# Altium project ESP 32 S Project.PrjPcb
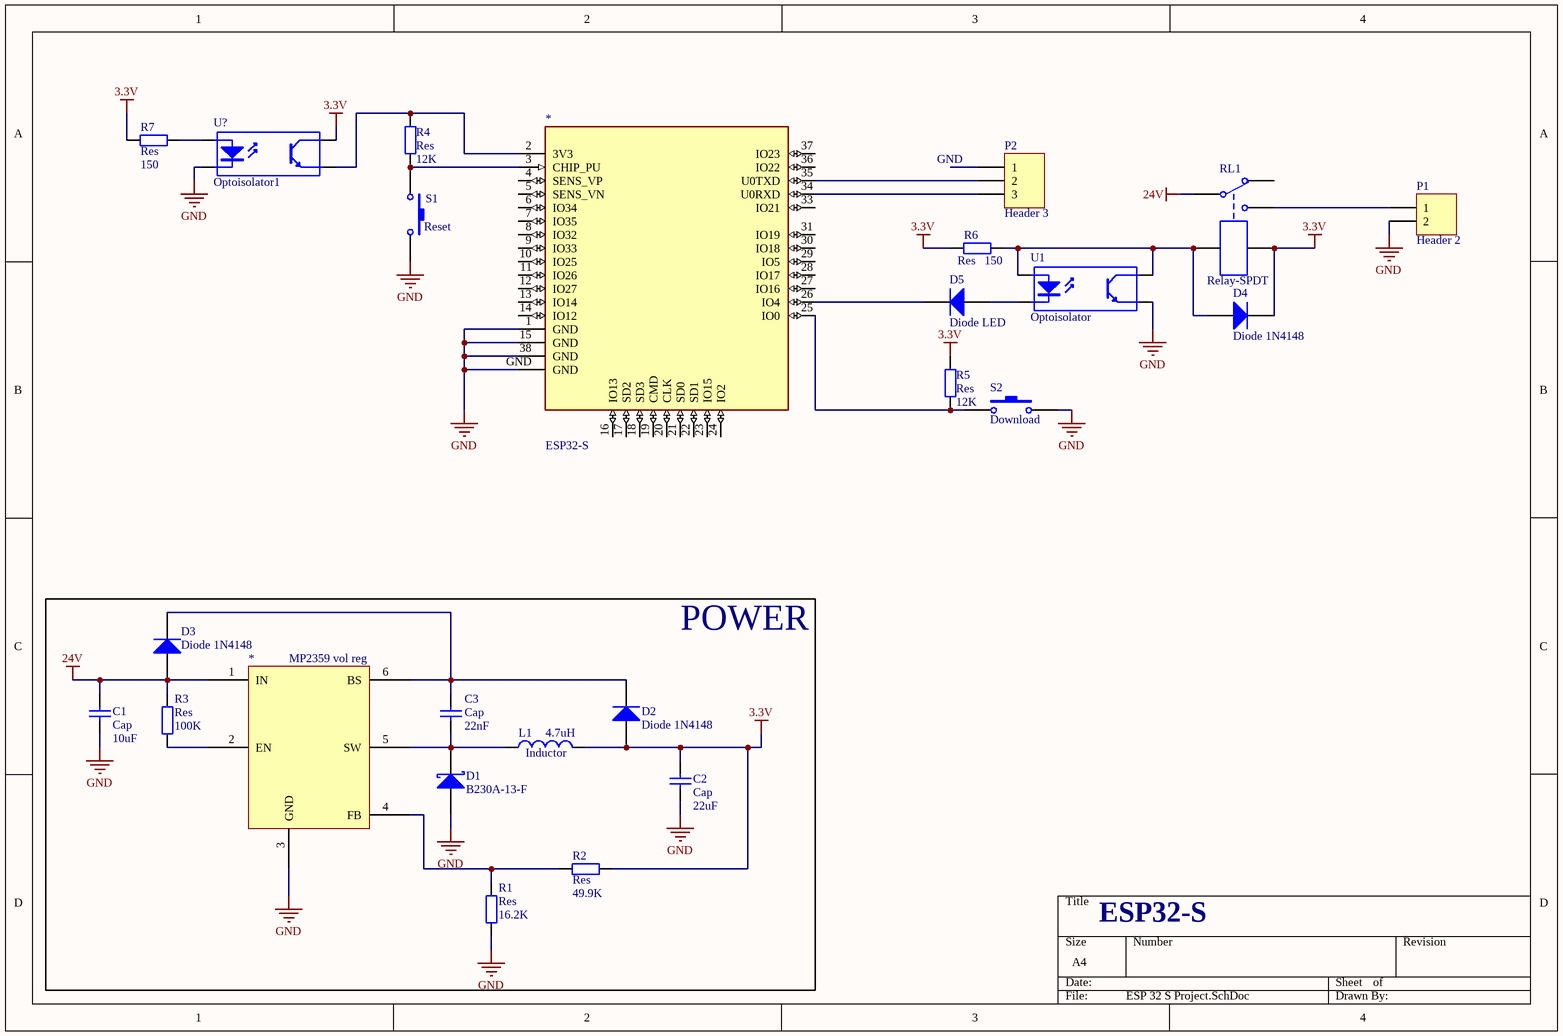
[diagram p0: ESP 32 S Project.SchDoc]
1 sheet, 25 parts. Net scope: global (net labels, ports and power ports of the same name join across sheets).
Board file: ESP 32 S Project PCB1.PcbDoc

## Sheet ESP 32 S Project.SchDoc
size A4

### Parts
(Parts that share a designator on the sheet are numbered #1, #2 ... from top to bottom, then left to right.)
*#1  ESP32-S
*#2  MP2359 vol reg  [MP2359 vol reg TSOT23-6]
C1  Cap  value 10uF  [RAD-0.3]
C2  Cap  value 22uF  [RAD-0.3]
C3  Cap  value 22nF  [RAD-0.3]
D1  B230A-13-F  [TO-220AC]
D2  Diode 1N4148  [DO-35]
D3  Diode 1N4148  [DO-35]
D4  Diode 1N4148  [DO-35]
D5  Diode LED  [DO-35]
L1  Inductor  value 4.7uH  [0402-A]
P1  Header 2  [HDR1X2]
P2  Header 3  [HDR1X3]
R1  Res  value 16.2K  [AXIAL-0.4]
R2  Res  value 49.9K  [AXIAL-0.4]
R3  Res  value 100K  [AXIAL-0.4]
R4  Res  value 12K  [AXIAL-0.4]
R5  Res  value 12K  [AXIAL-0.4]
R6  Res  value 150  [AXIAL-0.4]
R7  Res  value 150  [AXIAL-0.4]
RL1  Relay-SPDT  [MODULE5B]
S1  Reset  [SPST-2]
S2  Download  [SPST-2]
U1  Optoisolator  [DIP-4]
U?  Optoisolator1  [DIP-4]

### Blocks framed on the sheet
POWER: *#2 C1-C3 D1-D3 L1 R1-R3

### Nets
3.3V: C2.2 D2.1(A) D4.2(K) L1.2 R2.1 R5.1 R6.1 R7.1 RL1.5 U?.4(C)
24V: *#2.1(IN) C1.2 D3.1(A) R3.2 RL1.1
GND: *#1.1(GND) *#1.15(GND) *#1.38(GND) *#1.GND *#2.3(GND) C1.1 C2.1 D1.3(A) P1.2 R1.2 S1.2 S2.2 U1.3(E) U?.2(K)
Net*#1_2: *#1.2(3V3) R4.1 U?.3(E)
Net*#1_3: *#1.3(CHIP_PU) R4.2 S1.1
Net*#1_25: *#1.25(IO0) R5.2 S2.1
Net*#1_26: *#1.26(IO4) D5.2(K)
Net*#1_34: *#1.34(U0RXD) P2.3
Net*#1_35: *#1.35(U0TXD) P2.2
Net*#2_2: *#2.2(EN) R3.1
Net*#2_4: *#2.4(FB) R1.1 R2.2
Net*#2_5: *#2.5(SW) C3.1 D1.1(K) L1.1
Net*#2_6: *#2.6(BS) C3.2 D2.2(K) D3.2(K)
NetD4_1: D4.1(A) R6.2 RL1.4 U1.1(A) U1.4(C)
NetD5_1: D5.1(A) U1.2(K)
NetP1_1: P1.1 RL1.3
NetR7_2: R7.2 U?.1(A)

Not connected (* = marked no-connect by the designer): *#1 4(SENS_VP) 5(SENS_VN) 6(IO34) 7(IO35) 8(IO32) 9(IO33) 10(IO25) 11(IO26) 12(IO27) 13(IO14) 14(IO12) 16(IO13) 17(SD2) 18(SD3) 19(CMD) 20(CLK) 21(SD0) 22(SD1) 23(IO15) 24(IO2) 27(IO16) 28(IO17) 29(IO5) 30(IO18) 31(IO19) 33(IO21) 36(IO22) 37(IO23); P2 1; RL1 2

### Notes on the sheet
- (near P2) GND
- ESP32-S

### Library data of the parts
C1-C3 = Cap: Capacitor; Published: 8-Jun-2000; LatestRevisionDate: 17-Jul-2002; LatestRevisionNote: Re-released for DXP Platform.; PackageReference: RAD-0.3; Publisher: Altium Limited; PackageDescription: Radial Cap, Thru-Hole; 2 Leads; 0.3 in Pin Spacing
D1 = Diode 10TQ040: Schottky Rectifier; Note: Terminal 2 is the TAB and is electrically connected to the cathode; Published: 8-Jun-2000; LatestRevisionDate: 17-Jul-2002; LatestRevisionNote: Re-released for DXP Platform.; DatasheetVersion: PD-2.057B; PackageVersion: Feb-1998; PackageReference: TO-220AC; Publisher: Altium Limited; PackageDescription: TO, Thru-Hole, Vertical, Heatsink Mounted; 3 In-Line Leads (1 Absent); Pitch 2.54 mm; ComponentLink1Description: Manufacturer Link; ComponentLink1URL: http://www.irf.com/
D2-D5 = Diode 1N4148: High Conductance Fast Diode; Published: 8-Jun-2000; LatestRevisionDate: 17-Jul-2002; LatestRevisionNote: Re-released for DXP Platform.; DatasheetVersion: 1997; PackageReference: DO-35; Publisher: Altium Limited; PackageDescription: Diode, Axial; Body 3.8 x 1.9 mm (LxDia. max), Lead Dia. 0.53 mm (max); Code_JEDEC: DO-204-AH; ComponentLink1Description: Manufacturer Link; ComponentLink1URL: http://www.fairchildsemi.com/; ComponentLink2Description: Datasheet; ComponentLink2URL: http://www.fairchildsemi.com/ds/1N%2F1N4148.pdf
L1 = Inductor: Code_IEC: 1005; Published: 8-Jun-2000; LatestRevisionDate: 29-May-2009; LatestRevisionNote: IPC-7351 Footprint Added.; PackageReference: 0402-A; Publisher: Altium Limited; PackageDescription: Chip Inductor; Code_JEITA: 0402
P1 = Header 2: Header, 2-Pin; LatestRevisionDate: 17-Jul-2002; LatestRevisionNote: Re-released for DXP Platform.; Publisher: Altium Limited
P2 = Header 3: Header, 3-Pin; LatestRevisionDate: 17-Jul-2002; LatestRevisionNote: Re-released for DXP Platform.; Publisher: Altium Limited
R1-R7 = Res2: Resistor; Published: 8-Jun-2000; LatestRevisionDate: 17-Jul-2002; LatestRevisionNote: Re-released for DXP Platform.; PackageReference: AXIAL-0.4; Publisher: Altium Limited; PackageDescription: Axial Device, Thru-Hole; 2 Leads; 0.4 in Pin Spacing
RL1 = Relay-SPDT: Single-Pole Dual-Throw Relay; Published: 24-Mar-1999; LatestRevisionDate: 17-Jul-2002; LatestRevisionNote: Re-released for DXP Platform.; PackageReference: MODULE5B; Publisher: Altium Limited; ComponentLink1Description: Digikey; ComponentLink1URL: https://www.digikey.com/en/products/detail/omron-electronics-inc-emc-div/G5V-1-DC3/369039
S1 S2 = SW-PB: Switch; Published: 24-Mar-1999; LatestRevisionDate: 17-Jul-2002; LatestRevisionNote: Re-released for DXP Platform.; PackageReference: SPST-2; Publisher: Altium Limited; PackageDescription: Switch; 2 Leads
U1 = Optoisolator1: 4-Pin Phototransistor Optocoupler             https://www.ozdisan.com/optolar-ve-sensorler/optolar/transistor-cikisli-optokuplorler/LTV-816-C; Published: 24-Mar-1999; LatestRevisionDate: 04-Mar-2005; LatestRevisionNote: Sch pins 3 & 4 Swapped.; DatasheetVersion: Nov-2003; PackageReference: DIP-4; Publisher: Altium Limited
U? = Optoisolator1: 4-Pin Phototransistor Optocoupler; Published: 24-Mar-1999; LatestRevisionDate: 04-Mar-2005; LatestRevisionNote: Sch pins 3 & 4 Swapped.; DatasheetVersion: Nov-2003; PackageReference: DIP-4; Publisher: Altium Limited; ComponentLink1Description: Ozdisan; ComponentLink1URL: https://www.ozdisan.com/optolar-ve-sensorler/optolar/transistor-cikisli-optokuplorler/LTV-816-C
*#2 = MP2359 vol reg: ComponentLink1Description: Özdisan; ComponentLink1URL: https://www.ozdisan.com/entegre-devreler-ics/guc-entegreleri/dc-dc-voltaj-regulatorleri/MP2359DJ-LF-Z